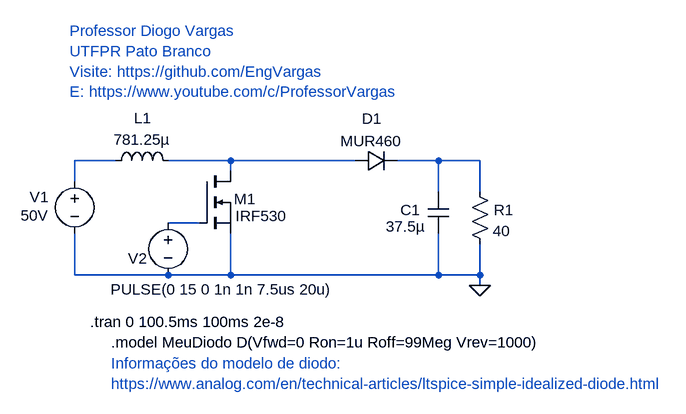
[diagram p0: schematic Conv-A04-Boost_CCM_(LTspice_nmos).asc]
Conv-A04-Boost_CCM_(LTspice_nmos).asc, the LTspice schematic file:
Version 4
SHEET 1 1168 680
WIRE 160 -64 96 -64
WIRE 336 -64 240 -64
WIRE 528 -64 336 -64
WIRE 656 -64 592 -64
WIRE 720 -64 656 -64
WIRE 336 -48 336 -64
WIRE 96 -32 96 -64
WIRE 656 -16 656 -64
WIRE 720 -16 720 -64
WIRE 288 32 240 32
WIRE 96 112 96 48
WIRE 240 112 96 112
WIRE 336 112 336 48
WIRE 336 112 240 112
WIRE 656 112 656 48
WIRE 656 112 336 112
WIRE 720 112 720 64
WIRE 720 112 656 112
WIRE 720 128 720 112
FLAG 720 128 0
SYMBOL voltage 96 -48 R0
WINDOW 3 -83 68 Left 2
WINDOW 0 -69 40 Left 2
WINDOW 123 0 0 Left 0
WINDOW 39 0 0 Left 0
SYMATTR Value 50V
SYMATTR InstName V1
SYMBOL voltage 240 16 R0
WINDOW 0 -47 55 Top 2
WINDOW 3 83 134 Bottom 2
WINDOW 123 0 0 Left 2
WINDOW 39 0 0 Left 2
SYMATTR InstName V2
SYMATTR Value PULSE(0 15 0 1n 1n 7.5us 20u)
SYMBOL nmos 288 -48 R0
WINDOW 0 53 43 Left 2
WINDOW 3 56 69 Left 2
SYMATTR InstName M1
SYMATTR Value IRF530
SYMBOL ind 144 -48 R270
WINDOW 0 66 57 VTop 2
WINDOW 3 64 56 VBottom 2
SYMATTR InstName L1
SYMATTR Value 781.25µ
SYMBOL cap 640 -16 R0
WINDOW 0 -12 28 Right 2
WINDOW 3 -4 53 Right 2
SYMATTR InstName C1
SYMATTR Value 37.5µ
SYMBOL res 704 -32 R0
WINDOW 0 37 44 Left 2
SYMATTR InstName R1
SYMATTR Value 40
SYMBOL diode 528 -48 R270
WINDOW 0 65 26 VTop 2
WINDOW 3 62 25 VBottom 2
SYMATTR InstName D1
SYMATTR Value MUR460
TEXT 120 184 Left 2 !.tran 0 100.5ms 100ms 2e-8
TEXT 88 -264 Left 2 ;Professor Diogo Vargas\nUTFPR Pato Branco\nVisite: https://github.com/EngVargas\nE: https://www.youtube.com/c/ProfessorVargas
TEXT 152 216 Left 2 !.model MeuDiodo D(Vfwd=0 Ron=1u Roff=99Meg Vrev=1000)
TEXT 152 248 Left 2 ;Informações do modelo de diodo:\nhttps://www.analog.com/en/technical-articles/ltspice-simple-idealized-diode.html

The netlist it stands for:
* Conv-A04-Boost_CCM_(LTspice_nmos).asc
V1 N001 0 50V
V2 N004 0 PULSE(0 15 0 1n 1n 7.5us 20u)
M1 N002 N004 0 0 IRF530
L1 N001 N002 781.25µ
C1 N003 0 37.5µ
R1 N003 0 40
D1 N002 N003 MUR460
.model D D
.lib standard.dio
.model NMOS NMOS
.model PMOS PMOS
.lib standard.mos
.tran 0 100.5ms 100ms 2e-8
* Professor Diogo Vargas
* UTFPR Pato Branco
* Visite: https://github.com/EngVargas
* E: https://www.youtube.com/c/ProfessorVargas
.model MeuDiodo D(Vfwd=0 Ron=1u Roff=99Meg Vrev=1000)
* Informações do modelo de diodo:
* https://www.analog.com/en/technical-articles/ltspice-simple-idealized-diode.html
.backanno
.end